# EAGLE design untitled (EAGLE 7.3.0)
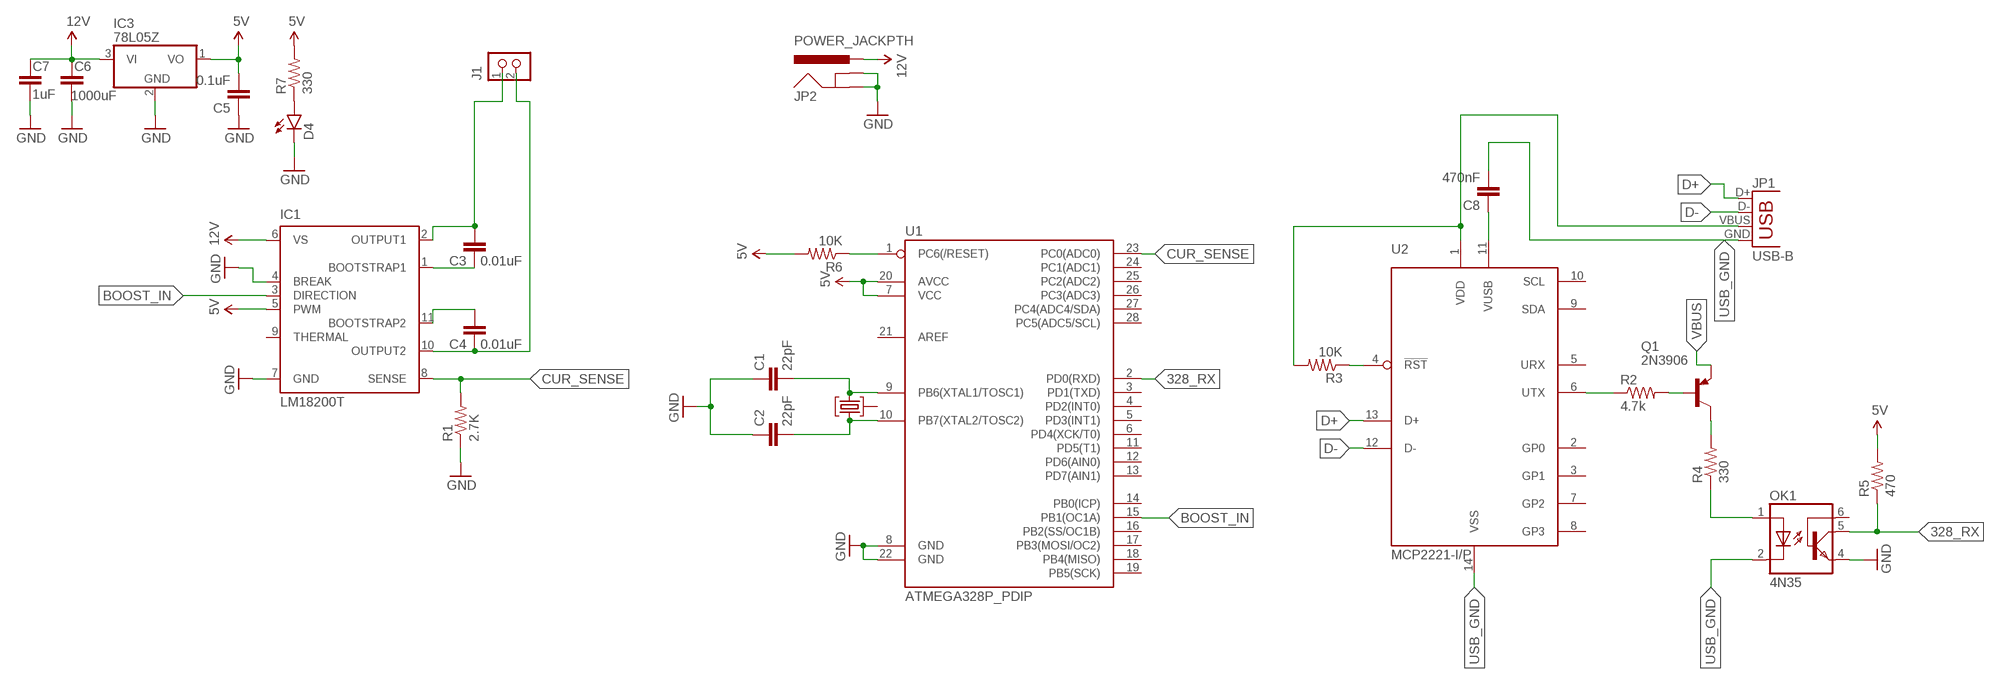
[diagram p0: schematic, sheet 1]

## Parts
C1  22pF  CAPEZ  [CAP-PTH-SMALLEZ]
C2  22pF  CAPEZ  [CAP-PTH-SMALLEZ]
C3  0.01uF  CAPEZ  [CAP-PTH-SMALLEZ]
C4  0.01uF  CAPEZ  [CAP-PTH-SMALLEZ]
C5  0.1uF  CAPEZ  [CAP-PTH-SMALLEZ]
C6  1000uF  CAPEZ  [CAP-PTH-SMALLEZ]
C7  1uF  CAPEZ  [CAP-PTH-SMALLEZ]
C8  470nF  CAPEZ  [CAP-PTH-SMALLEZ]
D4  LED-3MM-NO_SILK  [LED3MM-NS]
IC1  LM18200T  [TO-220-11]
IC3  78L05Z  [TO92]
J1  CON_TERMINAL_BLOCK_02-5MM  [TERMINAL_BLOCK_2P_5]
JP1  USB-B  USBPTH  [USB-B-PTH]
JP2  POWER_JACKPTH  [POWER_JACK_PTH]
OK1  4N35  [DIL06]
Q1  2N3906  [TO92]
QF1  8M10AHC49T  [HC49U]
R1  2.7K  RESISTORAXIAL-0.3  [AXIAL-0.3]
R2  4.7k  RESISTORAXIAL-0.3  [AXIAL-0.3]
R3  10K  RESISTORAXIAL-0.3  [AXIAL-0.3]
R4  330  RESISTORAXIAL-0.3  [AXIAL-0.3]
R5  470  RESISTORAXIAL-0.3  [AXIAL-0.3]
R6  10K  RESISTORAXIAL-0.3  [AXIAL-0.3]
R7  330  RESISTORAXIAL-0.3  [AXIAL-0.3]
U1  ATMEGA328P_PDIP  [DIL28-3]
U2  MCP2221-I/P  [DIL14]

## Nets
5V: C5.2 IC1.5(PWM) IC3.1(VO) R5.P$2 R6.P$2 R7.P$2 U1.7(VCC) U1.20(AVCC)
12V: C6.2 C7.2 IC1.6(VS) IC3.3(VI) JP2.PWR
328_RX: OK1.5(COL) R5.P$1 U1.2(PD0(RXD))
BOOST_IN: IC1.3(DIRECTION) U1.15(PB1(OC1A))
CUR_SENSE: IC1.8(SENSE) R1.P$2 U1.23(PC0(ADC0))
D+: JP1.D+ U2.13(D+)
D-: JP1.D- U2.12(D-)
GND: C1.1 C2.1 C5.1 C6.1 C7.1 D4.K(C) IC1.4(BREAK) IC1.7(GND) IC3.2(GND) JP2.GND JP2.GNDBREAK OK1.4(EMI) R1.P$1 U1.8(GND) U1.22(GND)
N$1: Q1.1(C) R4.P$2
N$2: C3.1 IC1.1(BOOTSTRAP1)
N$3: C8.1 U2.11(VUSB)
N$4: C4.2 IC1.11(BOOTSTRAP2)
N$5: R3.P$1 U2.4(!RST)
N$6: R2.P$1 U2.6(UTX)
N$7: Q1.2(B) R2.P$2
N$8: OK1.1(A) R4.P$1
N$10: C1.2 QF1.3 U1.9(PB6(XTAL1/TOSC1))
N$11: C2.2 QF1.1 U1.10(PB7(XTAL2/TOSC2))
N$13: R6.P$1 U1.1(PC6(/RESET))
N$14: D4.A R7.P$1
TRACK_1: C3.2 IC1.2(OUTPUT1) J1.1
TRACK_2: C4.1 IC1.10(OUTPUT2) J1.2
USB_GND: C8.2 JP1.GND OK1.2(C) U2.14(VSS)
VBUS: JP1.VBUS Q1.3(E) R3.P$2 U2.1(VDD)
Unconnected: IC1.9(THERMAL) OK1.6(BAS) QF1.2 U1.3(PD1(TXD)) U1.4(PD2(INT0)) U1.5(PD3(INT1)) U1.6(PD4(XCK/T0)) U1.11(PD5(T1)) U1.12(PD6(AIN0)) U1.13(PD7(AIN1)) U1.14(PB0(ICP)) U1.16(PB2(SS/OC1B)) U1.17(PB3(MOSI/OC2)) U1.18(PB4(MISO)) U1.19(PB5(SCK)) U1.21(AREF) U1.24(PC1(ADC1)) U1.25(PC2(ADC2)) U1.26(PC3(ADC3)) U1.27(PC4(ADC4/SDA)) U1.28(PC5(ADC5/SCL)) U2.2(GP0) U2.3(GP1) U2.5(URX) U2.7(GP2) U2.8(GP3) U2.9(SDA) U2.10(SCL)

## Library data of the parts
C1 C2 = SparkFun-Capacitors:CAP: Capacitor Standard 0603 ceramic capacitor, and 0.1" leaded capacitor.; MF: MURATA; MPN: DEC1X3J220JC4B; OC_FARNELL: 9527281
C3 C4 = SparkFun-Capacitors:CAP: Capacitor Standard 0603 ceramic capacitor, and 0.1" leaded capacitor.; MF: VISHAY BC COMPONENTS; MPN: D103K43Y5PH63L2R; OC_FARNELL: 1827843
C5 = SparkFun-Capacitors:CAP: Capacitor Standard 0603 ceramic capacitor, and 0.1" leaded capacitor.; MF: MULTICOMP; MPN: MCRH100V104M5X11; OC_FARNELL: 1902938
C6 = SparkFun-Capacitors:CAP: Capacitor Standard 0603 ceramic capacitor, and 0.1" leaded capacitor.; MF: MULTICOMP; MPN: MCGPR10V108M8X14; OC_FARNELL: 1902885
C7 = SparkFun-Capacitors:CAP: Capacitor Standard 0603 ceramic capacitor, and 0.1" leaded capacitor.; MF: MULTICOMP; MPN: MCNP16V105M5X11; OC_FARNELL: 1236655
C8 = SparkFun-Capacitors:CAP: Capacitor Standard 0603 ceramic capacitor, and 0.1" leaded capacitor.; MF: MULTICOMP; MPN: MCBU5471K5; OC_FARNELL: 9411771
D4 = SparkFun-LED:LED: LEDs Standard schematic elements and footprints for 5mm, 3mm, 1206, and 0603 sized LEDs. 5mm - Spark Fun Electronics SKU : COM-00529 (and others); MF: MULTICOMP; MPN: MCL034MD; OC_FARNELL: 1581113
IC1 = national-semiconductor:LM18200T: 3A, 55V H-Bridge Motor Control SourcE: http://cache.national.com/ds/LM/LMD18200.pdf; MF: TEXAS INSTRUMENTS; MPN: LMD18200T/NOPB; OC_FARNELL: 1468979; OC_NEWARK: unknown
IC3 = linear:78*: Positive VOLTAGE REGULATOR Source: http://cache.national.com/ds/LM/LM78L05.pdf http://www.fairchildsemi.com/ds/LM/LM7805.pdf; MF: STMICROELECTRONICS; MPN: L78L05ACZ; OC_FARNELL: 1467763
J1 = dp_devices:CON_TERMINAL_BLOCK_02: 2 poles wire to board terminal block; MF: CAMDENBOSS; MPN: CTB0102/2; OC_FARNELL: 2493614
JP1 = SparkFun-Connectors:USB: USB Connectors USB-B-PTH is fully proven SKU : PRT-00139/CONN-08278 USB-miniB is fully proven SKU : PRT-00587 USB-A-PCB is untested. USB-A-H is throughly reviewed, but untested. Spark Fun Electronics SKU : PRT-00437 USB-B-SMT is throughly reviewed, but untested. Needs silkscreen touching up. USB-A-S has not been used/tested USB-MB-H has not been used/tested USB-MICROB has been used. CONN-09505; MF: MULTICOMP; MPN: USB-B-S-RA.; OC_FARNELL: 1626770; PROD_ID: CONN-08278
JP2 = SparkFun-Connectors:POWER_JACK: Power Jack This is the standard 5.5mm barrel jack for power. The PTH is the most common, proven, reliable, footprint. The Slot footprint only works if the mill layer is transmitted to the PCB fab house so be warned. Mating wall wart : TOL-00298 (and others); MF: CLIFF ELECTRONIC COMPONENTS; MPN: DC10A; OC_FARNELL: 224959; PROD_ID: CONN-08197
OK1 = optocoupler:4N35: MOTOROLA OPTO COUPLER; MF: VISHAY; MPN: 4N35; OC_FARNELL: 1328375; OC_NEWARK: 72K9946
Q1 = transistor-pnp:2N3906: PNP Transistor; MF: MULTICOMP; MPN: 2N3906; OC_FARNELL: 1574372
QF1 = crystal:8M10AHC49T: Monolithic Crystal Filters Source: www.vanlong.com; MF: EUROQUARTZ; MPN: 16.000MHZ HC49/4H/30/50/40/18PF/ATF; OC_FARNELL: 1640875; OC_NEWARK: unknown
R1 = SparkFun-Resistors:RESISTOR: Resistor Basic schematic elements and footprints for 0603, 1206, and PTH resistors.; MF: MULTICOMP; MPN: MCRE000042; OC_FARNELL: 1700242
R2 = SparkFun-Resistors:RESISTOR: Resistor Basic schematic elements and footprints for 0603, 1206, and PTH resistors.; MF: MULTICOMP; MPN: MCRE000045; OC_FARNELL: 1700245
R3 R6 = SparkFun-Resistors:RESISTOR: Resistor Basic schematic elements and footprints for 0603, 1206, and PTH resistors.; MF: MULTICOMP; MPN: MCMF006FF1002A50; OC_FARNELL: 2401780
R4 R7 = SparkFun-Resistors:RESISTOR: Resistor Basic schematic elements and footprints for 0603, 1206, and PTH resistors.; MF: MULTICOMP; MPN: MCRE000031; OC_FARNELL: 1700230
R5 = SparkFun-Resistors:RESISTOR: Resistor Basic schematic elements and footprints for 0603, 1206, and PTH resistors.; MF: MULTICOMP; MPN: MCRE000033; OC_FARNELL: 1700232
U1 = SparkFun-DigitalIC:ATMEGA328P_PDIP: uC used in the Arduino 32kb flash, 1k EEPROM, 2k SRAM This is the through-hole version of this chip.; MF: ATMEL; MPN: ATMEGA328P-PU; OC_FARNELL: 1715487
U2 = microchip-mcp2221:MCP2221-*: MCP2221 in PDIP, SOIC and TSSOP package The MCP2221 is a USB-to-UART/I2C serial converter which enables USB connectivity in applications that have a UART and I2C interfaces. The device reduces external components by integrating the USB termination resistors and the oscillator needed for USB operation. The MCP2221 also has four GP pins providing miscellaneous functionalities (GPIO, USBCFG, SSPND, Clock Output, ADC, DAC, interrupt detector). Source: www.microchip.com/MCP2221 <http://www.microchip.com/wwwproducts/Devices.aspx?product=MCP2221> and www.microchipdirect.com <http://www.microchipdirect.com/ProductDetails.aspx?Category=MCP2221> Tutorial: MCP2221 by Arnauld Biganzoli <https://docs.google.com/document/d/1P3zzqCKdEXzCe--1Yyg8PClCZKsUri8pyNO7AV2daaw/edit?usp=sharing>; MF: MICROCHIP; MPN: MCP2221-I/P; OC_FARNELL: 2434892

## Board
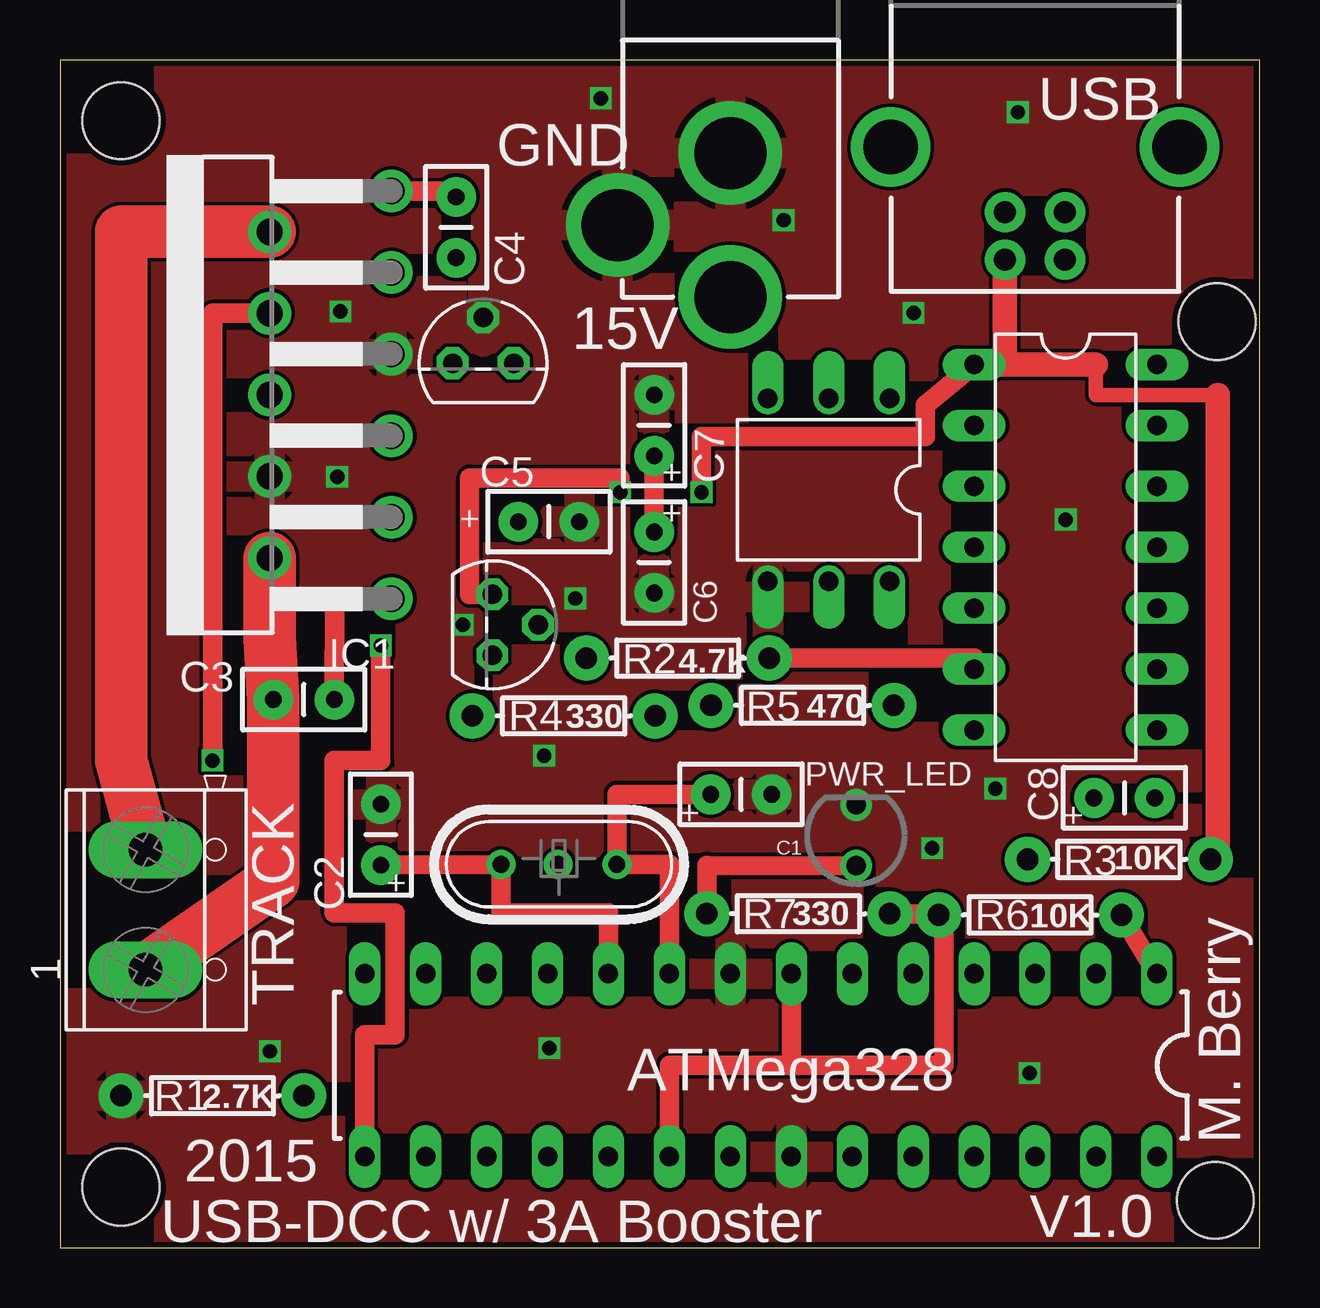
[diagram p1: board, top side]
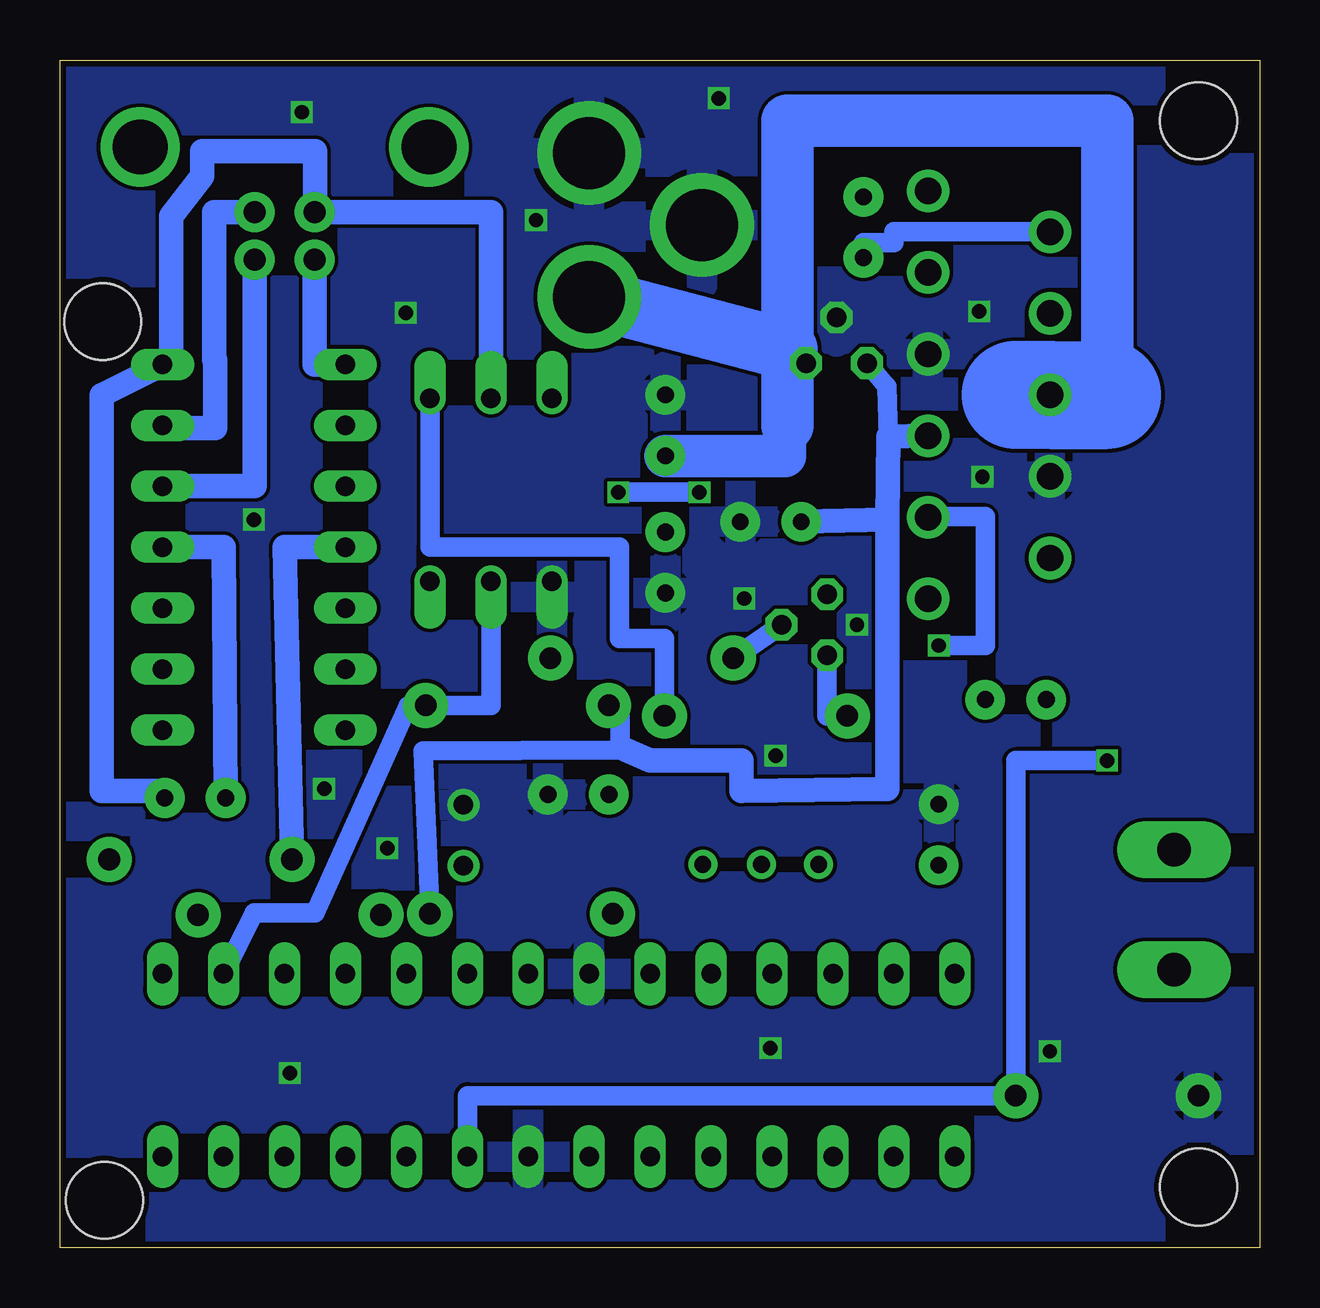
[diagram p2: board, bottom side, seen from below]

Size 50 x 49.52 mm. Coordinates in mm from the lower left corner, seen from the top.
Outline: 0,0 50,0 50,49.52 0,49.52 0,0
Copper layers (1*16): Top 0.035mm / dielectric 1.5mm / Bottom 0.035mm
Design rules "SeeedStudio_2layer_DRU_no_angle_20140221": minimum track width 6mil, minimum drill 12mil, track to track 6mil, track to pad 6mil, pad to pad 6mil, via to via 6mil, smd to smd 0mil, copper to edge 10mil, drill to drill 10mil, minimum pad ring 10mil, minimum via ring 6mil, stop-mask expansion 2mil, vias tented up to drill 100mil, thermal gap 10mil
Holes 3.2 mm at 2.54,46.99 2.54,2.54 48.15,1.99 48.22,38.61

### Footprints (pad centres in the part's own frame; a part is rotated, then mirrored left to right if it is on the bottom)
CAP-PTH-SMALLEZ = drill 0.7 pad 1.651: 1 0,0; 2 2.54,0
LED3MM-NS = drill 0.813: A -1.27,0; K 1.27,0
TO-220-11 = drill 1.1 pad 1.778: 1 -8.5,-9.37; 2 -6.8,-4.29; 3 -5.1,-9.37; 4 -3.4,-4.29; 5 -1.7,-9.37; 6 0,-4.29; 7 1.7,-9.37; 8 3.4,-4.29; 9 5.1,-9.37; 10 6.8,-4.29; 11 8.5,-9.37
TO92 = drill 0.813 octagon: 1 -1.27,0; 2 0,1.905; 3 1.27,0
TERMINAL_BLOCK_2P_5 = drill 1.4 pad 2.38 long: 1 2.5,-0.45; 2 -2.5,-0.45
USB-B-PTH = drill 0.914 pad 1.676: D+ 0,1.25; D- 1.981,1.25; GND 0,-1.25; VBUS 1.981,-1.25 | drill 2.286: S1 -2.718,-6.02; S2 -2.718,6.02
POWER_JACK_PTH = drill 2.997 pad 4.318: GND 0,7.7; GNDBREAK 4.7,10.7; PWR 0,13.7
DIL06 = drill 0.813 offset: 1 -2.54,-3.81; 2 0,-3.81; 3 2.54,-3.81; 4 2.54,3.81; 5 0,3.81; 6 -2.54,3.81
TO92' = drill 0.813 octagon: 1 1.27,0; 2 0,1.905; 3 -1.27,0
HC49U = drill 0.7 pad 1.2: 1 -2.413,0; 2 -0.027,0; 3 2.413,0
AXIAL-0.3 = drill 0.9 pad 1.88: P$1 -3.81,0; P$2 3.81,0
DIL28-3 = drill 0.813 long: 1 -16.51,-3.81; 2 -13.97,-3.81; 3 -11.43,-3.81; 4 -8.89,-3.81; 5 -6.35,-3.81; 6 -3.81,-3.81; 7 -1.27,-3.81; 8 1.27,-3.81; 9 3.81,-3.81; 10 6.35,-3.81; 11 8.89,-3.81; 12 11.43,-3.81; 13 13.97,-3.81; 14 16.51,-3.81; 15 16.51,3.81; 16 13.97,3.81; 17 11.43,3.81; 18 8.89,3.81; 19 6.35,3.81; 20 3.81,3.81; 21 1.27,3.81; 22 -1.27,3.81; 23 -3.81,3.81; 24 -6.35,3.81; 25 -8.89,3.81; 26 -11.43,3.81; 27 -13.97,3.81; 28 -16.51,3.81
DIL14 = drill 0.813 long: 1 -7.62,-3.81; 2 -5.08,-3.81; 3 -2.54,-3.81; 4 0,-3.81; 5 2.54,-3.81; 6 5.08,-3.81; 7 7.62,-3.81; 8 7.62,3.81; 9 5.08,3.81; 10 2.54,3.81; 11 0,3.81; 12 -2.54,3.81; 13 -5.08,3.81; 14 -7.62,3.81

### Placement (x,y rotation side)
C1  29.66,18.91 180 top
C2  13.37,18.5 270 top
C3  11.43,22.86 180 top
C4  16.51,41.27 90 top
C5  21.64,30.27 180 top
C6  24.77,27.3 90 top
C7  24.77,35.56 270 top
C8  43.09,18.76 0 top
D4  33.18,17.2 90 top
IC1  4.45,35.56 90 top
IC3  17.63,36.88 0 top
J1  4.02,14.1 270 top
JP1  40.64,43.18 270 top
JP2  27.94,53.34 180 top
OK1  32.04,31.61 180 top
Q1  2N3906  [TO92']  18.02,25.98 270 top
QF1  20.79,15.99 0 top
R1  6.35,6.35 0 top
R2  25.75,24.59 180 top
R3  44.14,16.2 0 top
R4  20.99,22.18 180 top
R5  30.94,22.62 180 top
R6  40.43,13.88 180 top
R7  30.77,13.93 0 top
U1  29.21,7.62 180 top
U2  41.91,29.21 270 top

### Tracks (layer width: path | path; a pad name or v marks a point on that pad's centre or on a via)
5V
  Top 0.813: U1.7 30.48,7.62 | 30.48,7.62 25.4,7.62 U1.20 | R6.P$2 36.83,13.97 36.83,13.93 | 36.83,13.93 36.83,7.62 30.48,7.62 | R7.P$2 36.83,13.93
  Bottom 0.813: 15.47,33.82 15.54,35.9 IC3.1 | 26.4,20.77 26.67,20.76 | 26.67,20.76 34.86,20.72 R7.P$2 | R5.P$2 26.67,22.62 26.67,20.76
  Bottom 1.016: 15.51,30.36 15.47,33.82 IC1.5 | C5.2 15.51,30.36 | 15.51,30.36 15.51,19.14 21.59,19.05 21.59,20.32 25.4,20.32 26.4,20.77
12V
  Top 0.813: C6.2 C7.2
  Bottom 0.813: IC3.3 20.44,36.9 20.44,37.66
  Bottom 1.778: 19.69,34.29 19.79,34.29 19.79,33.01 C7.2
  Bottom 2.184: 19.69,34.29 19.69,37.46 19.69,46.99 6.35,46.99 6.35,35.56
  Bottom 2.54: JP2.PWR 20.44,37.66 19.69,37.46
  Bottom 4.5: 10.16,35.56 IC1.6 6.35,35.56
328_RX
  Bottom 0.813: OK1.5 32.04,22.62 R5.P$1 35.49,22.6 39.37,13.97 41.91,13.97 U1.2
BOOST_IN  (via drill 0.6)
  Top 0.813: U1.15 12.7,8.89 13.97,8.89 13.97,13.97 11.43,13.97 11.43,20.32 13.37,20.32 v13.37,25.11
  Bottom 0.813: v13.37,25.11 11.43,25.11 11.43,30.48 13.81,30.48 IC1.3
CUR_SENSE  (via drill 0.6)
  Top 0.813: IC1.8 6.35,38.96 v6.35,20.32
  Bottom 0.813: U1.23 33.02,6.35 R1.P$2 10.16,20.32 v6.35,20.32
D+
  Bottom 1.016: JP1.D+ 43.58,43.18 43.58,37.04 43.53,37.04 43.53,34.17 45.72,34.17 U2.13
D-
  Bottom 1.016: U2.12 41.89,31.75 JP1.D-
GND  (via drill 0.6)
  other vias: 8.74,8.2 20.17,20.52 16.78,25.98 20.39,8.33 40.41,7.29 36.35,16.67 38.99,19.15 35.58,38.98 11.68,39.04 21.47,27.07 30.16,42.84 11.55,32.14 39.92,47.34 41.92,30.36 22.54,47.92
  pour Bottom: -52.07,57.15 58.42,57.15 58.42,-39.37 -57.15,-39.37 -57.15,57.15
  pour Top: -58.42,62.23 66.04,62.23 66.04,-45.72 -60.96,-45.72 -60.96,62.23
N$1
  Bottom 0.813: R4.P$2 18.02,22.18 Q1.1
N$2
  Top 0.813: C3.1 11.43,27.01 IC1.1
N$3
  Bottom 1.016: C8.1 43.18,29.21 U2.11
N$4
  Top 0.813: IC1.11 16.51,44.06 C4.2
N$5
  Bottom 1.016: R3.P$1 40.64,29.21 U2.4
N$6
  Top 0.813: R2.P$1 38.1,24.59 U2.6
N$7
  Bottom 0.813: Q1.2 R2.P$2
N$8
  Bottom 0.813: OK1.1 34.58,29.21 26.67,29.21 26.67,25.4 24.8,25.4 R4.P$1
N$10
  Top 0.813: C1.2 23.2,18.91 QF1.3 25.4,15.99 U1.9
N$11
  Top 0.813: C2.2 QF1.1 18.38,13.97 22.86,13.97 U1.10
N$13
  Top 0.813: U1.1 R6.P$1
N$14
  Top 0.813: R7.P$1 26.96,15.96 D4.A
TRACK_1
  Top 2.184: J1.1 8.89,15.28 C3.2 8.73,25.4 IC1.2
TRACK_2
  Top 2.184: J1.2 2.54,20.32 2.54,42.36 IC1.10
  Bottom 0.813: IC1.10 15.24,42.36 15.24,41.91 16.51,41.91 C4.1
USB_GND
  Bottom 1.016: C8.2 45.72,19.05 48.26,19.05 48.26,35.56 U2.14 45.37,36.83 45.37,43.01 44.07,44.67 44.07,45.72 39.37,45.72 39.37,43.18 JP1.GND 32.04,43.18 OK1.2
VBUS  (via drill 0.6)
  Top 0.61: 43.18,36.83 43.18,35.56 48.26,35.56
  Top 0.813: Q1.3 17.07,27.25 17.07,32.1 23.35,32.1 v23.35,31.5 | U2.1 36.06,35.13 36.06,33.82 26.73,33.82 v26.73,31.5
  Top 1.016: JP1.VBUS 39.39,36.83 | 39.39,36.83 U2.1 | 39.39,36.83 43.18,36.83 | R3.P$2 48.26,16.2 48.26,35.56
  Bottom 0.813: v23.35,31.5 v26.73,31.5
  Bottom 1.016: U2.1 39.39,36.83 JP1.VBUS

### Text on the board
tPlace: USB | GND | 15V | + | + | + | PWR_LED | + | + | + | M. Berry | TRACK | ATMega328 | 2015 | USB-DCC w/ 3A Booster | V1.0